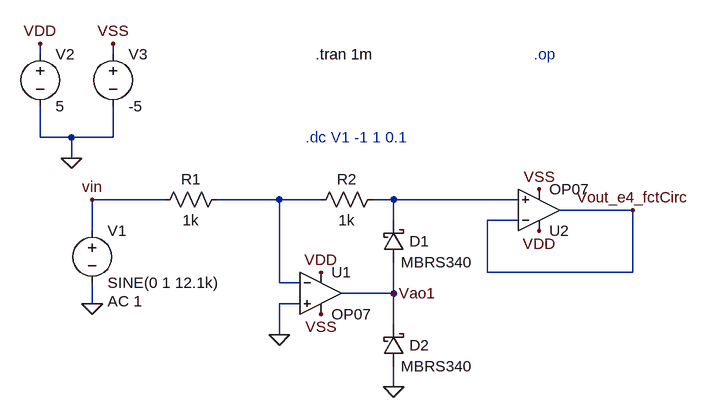
[diagram p0: schematic etaj4_refacut.asc]
etaj4_refacut.asc, the LTspice schematic file:
Version 4
SHEET 1 880 680
WIRE -512 -224 -512 -240
WIRE -400 -224 -400 -240
WIRE -512 -96 -512 -144
WIRE -464 -96 -512 -96
WIRE -400 -96 -400 -144
WIRE -400 -96 -464 -96
WIRE -464 -64 -464 -96
WIRE -320 0 -432 0
WIRE -144 0 -240 0
WIRE -80 0 -144 0
WIRE 32 0 0 0
WIRE 224 0 32 0
WIRE 400 16 288 16
WIRE 32 32 32 0
WIRE 224 32 176 32
WIRE -432 48 -432 0
WIRE 176 112 176 32
WIRE 400 112 400 16
WIRE 400 112 176 112
WIRE -144 128 -144 0
WIRE -112 128 -144 128
WIRE 32 144 32 96
WIRE 32 144 -48 144
WIRE -432 160 -432 128
WIRE -112 160 -144 160
WIRE 32 192 32 144
WIRE -144 208 -144 160
WIRE 32 288 32 256
FLAG -144 208 0
FLAG 32 288 0
FLAG -432 160 0
FLAG -432 0 vin
FLAG 400 16 Vout_e4_fctCirc
FLAG 256 48 VDD
FLAG 256 -16 VSS
FLAG -80 176 VSS
FLAG -80 112 VDD
FLAG 32 144 Vao1
FLAG -512 -240 VDD
FLAG -400 -240 VSS
FLAG -464 -64 0
SYMBOL OpAmps\\OP07 -80 80 R0
SYMATTR InstName U1
SYMBOL res -224 -16 R90
WINDOW 0 0 56 VBottom 2
WINDOW 3 32 56 VTop 2
SYMATTR InstName R1
SYMATTR Value 1k
SYMBOL res 16 -16 R90
WINDOW 0 0 56 VBottom 2
WINDOW 3 32 56 VTop 2
SYMATTR InstName R2
SYMATTR Value 1k
SYMBOL voltage -432 32 R0
WINDOW 123 24 124 Left 2
WINDOW 39 0 0 Left 0
SYMATTR Value2 AC 1
SYMATTR InstName V1
SYMATTR Value SINE(0 1 12.1k)
SYMBOL OpAmps\\OP07 256 80 M180
SYMATTR InstName U2
SYMBOL schottky 16 96 M180
WINDOW 0 40 32 Left 2
WINDOW 3 27 0 Left 2
SYMATTR InstName D1
SYMATTR Value MBRS340
SYMATTR Description Diode
SYMATTR Type diode
SYMBOL schottky 16 256 M180
WINDOW 0 40 32 Left 2
WINDOW 3 27 0 Left 2
SYMATTR InstName D2
SYMATTR Value MBRS340
SYMATTR Description Diode
SYMATTR Type diode
SYMBOL voltage -512 -240 R0
WINDOW 123 0 0 Left 0
WINDOW 39 0 0 Left 0
SYMATTR InstName V2
SYMATTR Value 5
SYMBOL voltage -400 -240 R0
WINDOW 123 0 0 Left 0
WINDOW 39 0 0 Left 0
SYMATTR InstName V3
SYMATTR Value -5
TEXT -104 -96 Left 2 ;.dc V1 -1 1 0.1
TEXT -88 -224 Left 2 !.tran 1m
TEXT 248 -224 Left 2 ;.op

The netlist it stands for:
* etaj4_refacut.asc
XU1 0 N001 VDD VSS Vao1 LT1001  ; OP07, pins In+ In- V+ V- OUT
R1 N001 vin 1k
R2 N002 N001 1k
V1 vin 0 SINE(0 1 12.1k) AC 1
XU2 N002 Vout_e4_fctCirc VDD VSS Vout_e4_fctCirc LT1001  ; OP07, pins In+ In- V+ V- OUT
D1 Vao1 N002 MBRS340
D2 0 Vao1 MBRS340
V2 VDD 0 5
V3 VSS 0 -5
.model D D
.lib standard.dio
* .dc V1 -1 1 0.1
.tran 1m
* .op
.lib LTC.lib
.backanno
.end